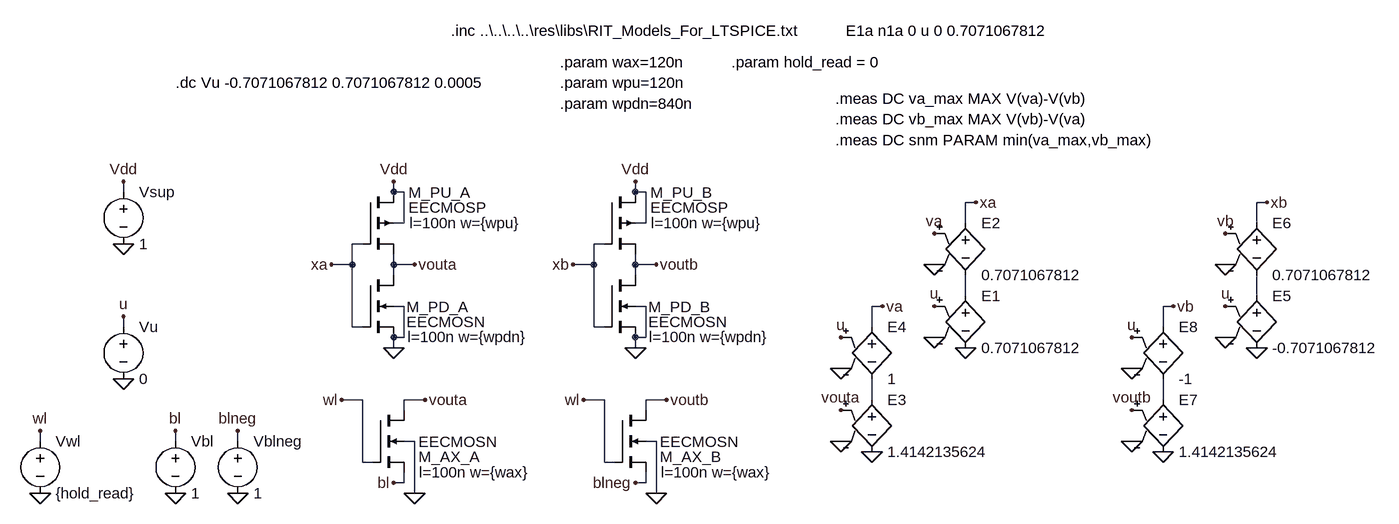
[diagram p0: schematic sram_seevinck.asc]
sram_seevinck.asc, the LTspice schematic file:
Version 4
SHEET 1 3232 1060
WIRE -464 0 -464 -16
WIRE -48 0 -48 -16
WIRE -32 0 -48 0
WIRE 324 0 324 -16
WIRE 340 0 324 0
WIRE 848 16 832 16
WIRE 1296 16 1280 16
WIRE -32 48 -32 0
WIRE -32 48 -48 48
WIRE 340 48 340 0
WIRE 340 48 324 48
WIRE 832 48 832 16
WIRE 1280 48 1280 16
WIRE -96 80 -112 80
WIRE 276 80 260 80
WIRE -112 112 -112 80
WIRE -112 112 -144 112
WIRE -48 112 -48 96
WIRE -16 112 -48 112
WIRE 260 112 260 80
WIRE 260 112 228 112
WIRE 324 112 324 96
WIRE 356 112 324 112
WIRE -48 128 -48 112
WIRE 324 128 324 112
WIRE 832 160 832 128
WIRE 1280 160 1280 128
WIRE -32 176 -48 176
WIRE 340 176 324 176
WIRE 704 176 688 176
WIRE 1152 176 1136 176
WIRE -464 208 -464 192
WIRE -112 208 -112 112
WIRE -96 208 -112 208
WIRE 260 208 260 112
WIRE 276 208 260 208
WIRE 688 208 688 176
WIRE 1136 208 1136 176
WIRE -32 224 -32 176
WIRE -32 224 -48 224
WIRE 340 224 340 176
WIRE 340 224 324 224
WIRE -48 240 -48 224
WIRE 324 240 324 224
WIRE -96 320 -128 320
WIRE 0 320 -32 320
WIRE 276 320 244 320
WIRE 372 320 340 320
WIRE 688 320 688 288
WIRE 1136 320 1136 288
WIRE -32 336 -32 320
WIRE 340 336 340 320
WIRE -592 384 -592 368
WIRE -384 384 -384 368
WIRE -288 384 -288 368
WIRE -16 384 -32 384
WIRE 356 384 340 384
WIRE -96 416 -96 320
WIRE -80 416 -96 416
WIRE 276 416 276 320
WIRE 292 416 276 416
WIRE -32 448 -32 432
WIRE -32 448 -48 448
WIRE 340 448 340 432
WIRE 340 448 324 448
WIRE -16 464 -16 384
WIRE 356 464 356 384
FLAG -48 240 0
FLAG -48 -16 Vdd
FLAG -144 112 xa
FLAG -16 112 vouta
FLAG -48 448 bl
FLAG -128 320 wl
FLAG 0 320 vouta
FLAG -16 464 0
FLAG -464 -16 Vdd
FLAG -464 80 0
FLAG -464 192 u
FLAG -464 288 0
FLAG -592 368 wl
FLAG -592 464 0
FLAG -384 368 bl
FLAG -384 464 0
FLAG -288 368 blneg
FLAG -288 464 0
FLAG 324 240 0
FLAG 324 -16 Vdd
FLAG 228 112 xb
FLAG 356 112 voutb
FLAG 324 448 blneg
FLAG 244 320 wl
FLAG 372 320 voutb
FLAG 356 464 0
FLAG 832 240 0
FLAG 848 16 xa
FLAG 784 176 u
FLAG 784 64 va
FLAG 784 112 0
FLAG 784 224 0
FLAG 688 400 0
FLAG 704 176 va
FLAG 640 336 vouta
FLAG 640 224 u
FLAG 640 272 0
FLAG 640 384 0
FLAG 1280 240 0
FLAG 1296 16 xb
FLAG 1232 176 u
FLAG 1232 64 vb
FLAG 1232 112 0
FLAG 1232 224 0
FLAG 1136 400 0
FLAG 1152 176 vb
FLAG 1088 336 voutb
FLAG 1088 224 u
FLAG 1088 272 0
FLAG 1088 384 0
SYMBOL pmos4 -96 0 R0
WINDOW 0 71 1 Left 2
WINDOW 3 71 24 Left 2
WINDOW 123 72 48 Left 2
SYMATTR InstName M_PU_A
SYMATTR Value EECMOSP
SYMATTR Value2 l=100n w={wpu}
SYMBOL nmos4 -96 128 R0
WINDOW 0 68 49 Left 2
WINDOW 3 68 72 Left 2
WINDOW 123 69 95 Left 2
SYMATTR InstName M_PD_A
SYMATTR Value EECMOSN
SYMATTR Value2 l=100n w={wpdn}
SYMBOL nmos4 -80 336 R0
WINDOW 0 70 72 Left 2
WINDOW 3 70 49 Left 2
WINDOW 123 71 96 Left 2
SYMATTR InstName M_AX_A
SYMATTR Value EECMOSN
SYMATTR Value2 l=100n w={wax}
SYMBOL voltage -464 -16 R0
WINDOW 123 0 0 Left 0
WINDOW 39 0 0 Left 0
SYMATTR InstName Vsup
SYMATTR Value 1
SYMBOL voltage -464 192 R0
WINDOW 123 0 0 Left 0
WINDOW 39 0 0 Left 0
SYMATTR InstName Vu
SYMATTR Value 0
SYMBOL voltage -592 368 R0
WINDOW 123 0 0 Left 0
WINDOW 39 0 0 Left 0
SYMATTR InstName Vwl
SYMATTR Value {hold_read}
SYMBOL voltage -384 368 R0
WINDOW 123 0 0 Left 0
WINDOW 39 0 0 Left 0
SYMATTR InstName Vbl
SYMATTR Value 1
SYMBOL voltage -288 368 R0
WINDOW 123 0 0 Left 0
WINDOW 39 0 0 Left 0
SYMATTR InstName Vblneg
SYMATTR Value 1
SYMBOL pmos4 276 0 R0
WINDOW 0 71 1 Left 2
WINDOW 3 71 24 Left 2
WINDOW 123 72 48 Left 2
SYMATTR InstName M_PU_B
SYMATTR Value EECMOSP
SYMATTR Value2 l=100n w={wpu}
SYMBOL nmos4 276 128 R0
WINDOW 0 68 49 Left 2
WINDOW 3 68 72 Left 2
WINDOW 123 69 95 Left 2
SYMATTR InstName M_PD_B
SYMATTR Value EECMOSN
SYMATTR Value2 l=100n w={wpdn}
SYMBOL nmos4 292 336 R0
WINDOW 0 70 72 Left 2
WINDOW 3 70 49 Left 2
WINDOW 123 71 96 Left 2
SYMATTR InstName M_AX_B
SYMATTR Value EECMOSN
SYMATTR Value2 l=100n w={wax}
SYMBOL e 832 144 R0
SYMATTR InstName E1
SYMATTR Value 0.7071067812
SYMBOL e 832 32 R0
SYMATTR InstName E2
SYMATTR Value 0.7071067812
SYMBOL e 688 304 R0
SYMATTR InstName E3
SYMATTR Value 1.4142135624
SYMBOL e 688 192 R0
SYMATTR InstName E4
SYMATTR Value 1
SYMBOL e 1280 144 R0
SYMATTR InstName E5
SYMATTR Value -0.7071067812
SYMBOL e 1280 32 R0
SYMATTR InstName E6
SYMATTR Value 0.7071067812
SYMBOL e 1136 304 R0
SYMATTR InstName E7
SYMATTR Value 1.4142135624
SYMBOL e 1136 192 R0
SYMATTR InstName E8
SYMATTR Value -1
TEXT 40 -248 Left 2 !.inc ..\\..\\..\\..\\res\\libs\\RIT_Models_For_LTSPICE.txt
TEXT 208 -200 Left 2 !.param wax=120n
TEXT 208 -168 Left 2 !.param wpu=120n
TEXT 208 -136 Left 2 !.param wpdn=840n
TEXT 472 -200 Left 2 !.param hold_read = 0
TEXT -384 -168 Left 2 !.dc Vu -0.7071067812 0.7071067812 0.0005
TEXT 648 -248 Left 2 !E1a n1a 0 u 0 0.7071067812
TEXT 632 -144 Left 2 !.meas DC va_max MAX V(va)-V(vb)
TEXT 632 -112 Left 2 !.meas DC vb_max MAX V(vb)-V(va)
TEXT 632 -80 Left 2 !.meas DC snm PARAM min(va_max,vb_max)

The netlist it stands for:
* sram_seevinck.asc
M_PU_A Vdd xa vouta Vdd EECMOSP l=100n w={wpu}
M_PD_A vouta xa 0 0 EECMOSN l=100n w={wpdn}
M_AX_A vouta wl bl 0 EECMOSN l=100n w={wax}
Vsup Vdd 0 1
Vu u 0 0
Vwl wl 0 {hold_read}
Vbl bl 0 1
Vblneg blneg 0 1
M_PU_B Vdd xb voutb Vdd EECMOSP l=100n w={wpu}
M_PD_B voutb xb 0 0 EECMOSN l=100n w={wpdn}
M_AX_B voutb wl blneg 0 EECMOSN l=100n w={wax}
E1 N001 0 u 0 0.7071067812
E2 xa N001 va 0 0.7071067812
E3 N003 0 vouta 0 1.4142135624
E4 va N003 u 0 1
E5 N002 0 u 0 -0.7071067812
E6 xb N002 vb 0 0.7071067812
E7 N004 0 voutb 0 1.4142135624
E8 vb N004 u 0 -1
.model NMOS NMOS
.model PMOS PMOS
.lib standard.mos
.inc ..\..\..\..\res\libs\RIT_Models_For_LTSPICE.txt
.param wax=120n
.param wpu=120n
.param wpdn=840n
.param hold_read = 0
.dc Vu -0.7071067812 0.7071067812 0.0005
E1a n1a 0 u 0 0.7071067812
.meas DC va_max MAX V(va)-V(vb)
.meas DC vb_max MAX V(vb)-V(va)
.meas DC snm PARAM min(va_max,vb_max)
.backanno
.end